# Altium schematic sheet ASM001-design-1.SchDoc
size 558 x 431 mm
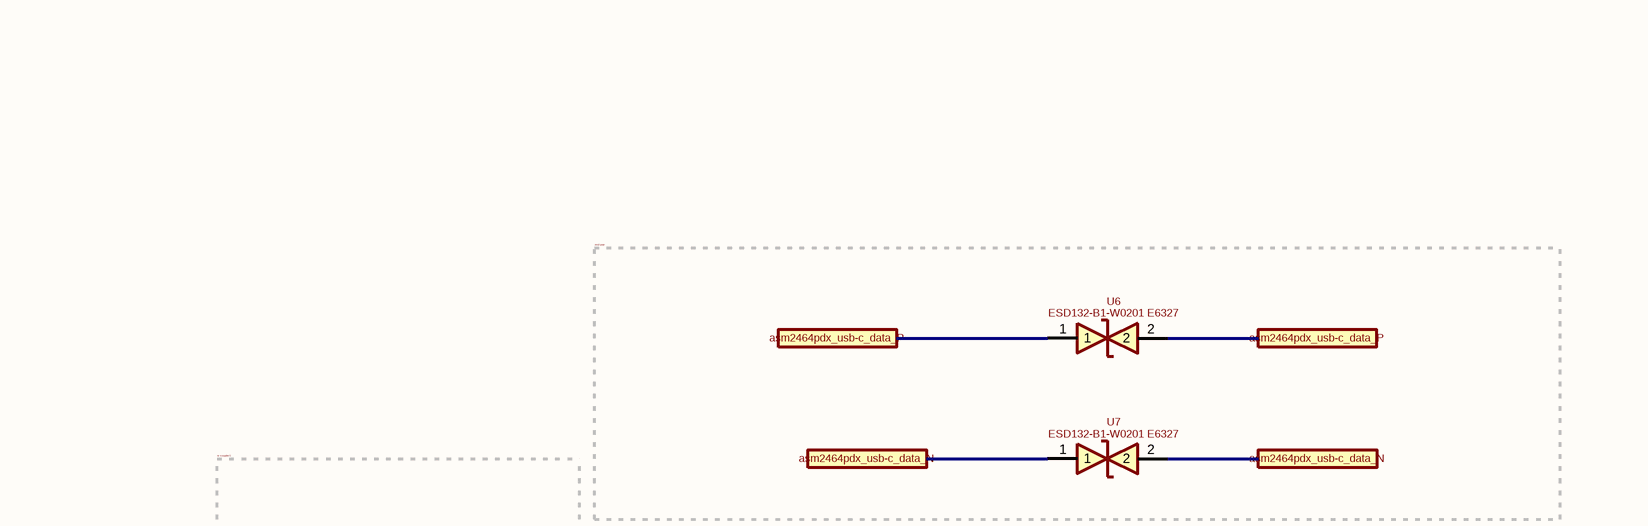
[diagram p0: ASM001-design-1.SchDoc, top column 2 of 4]
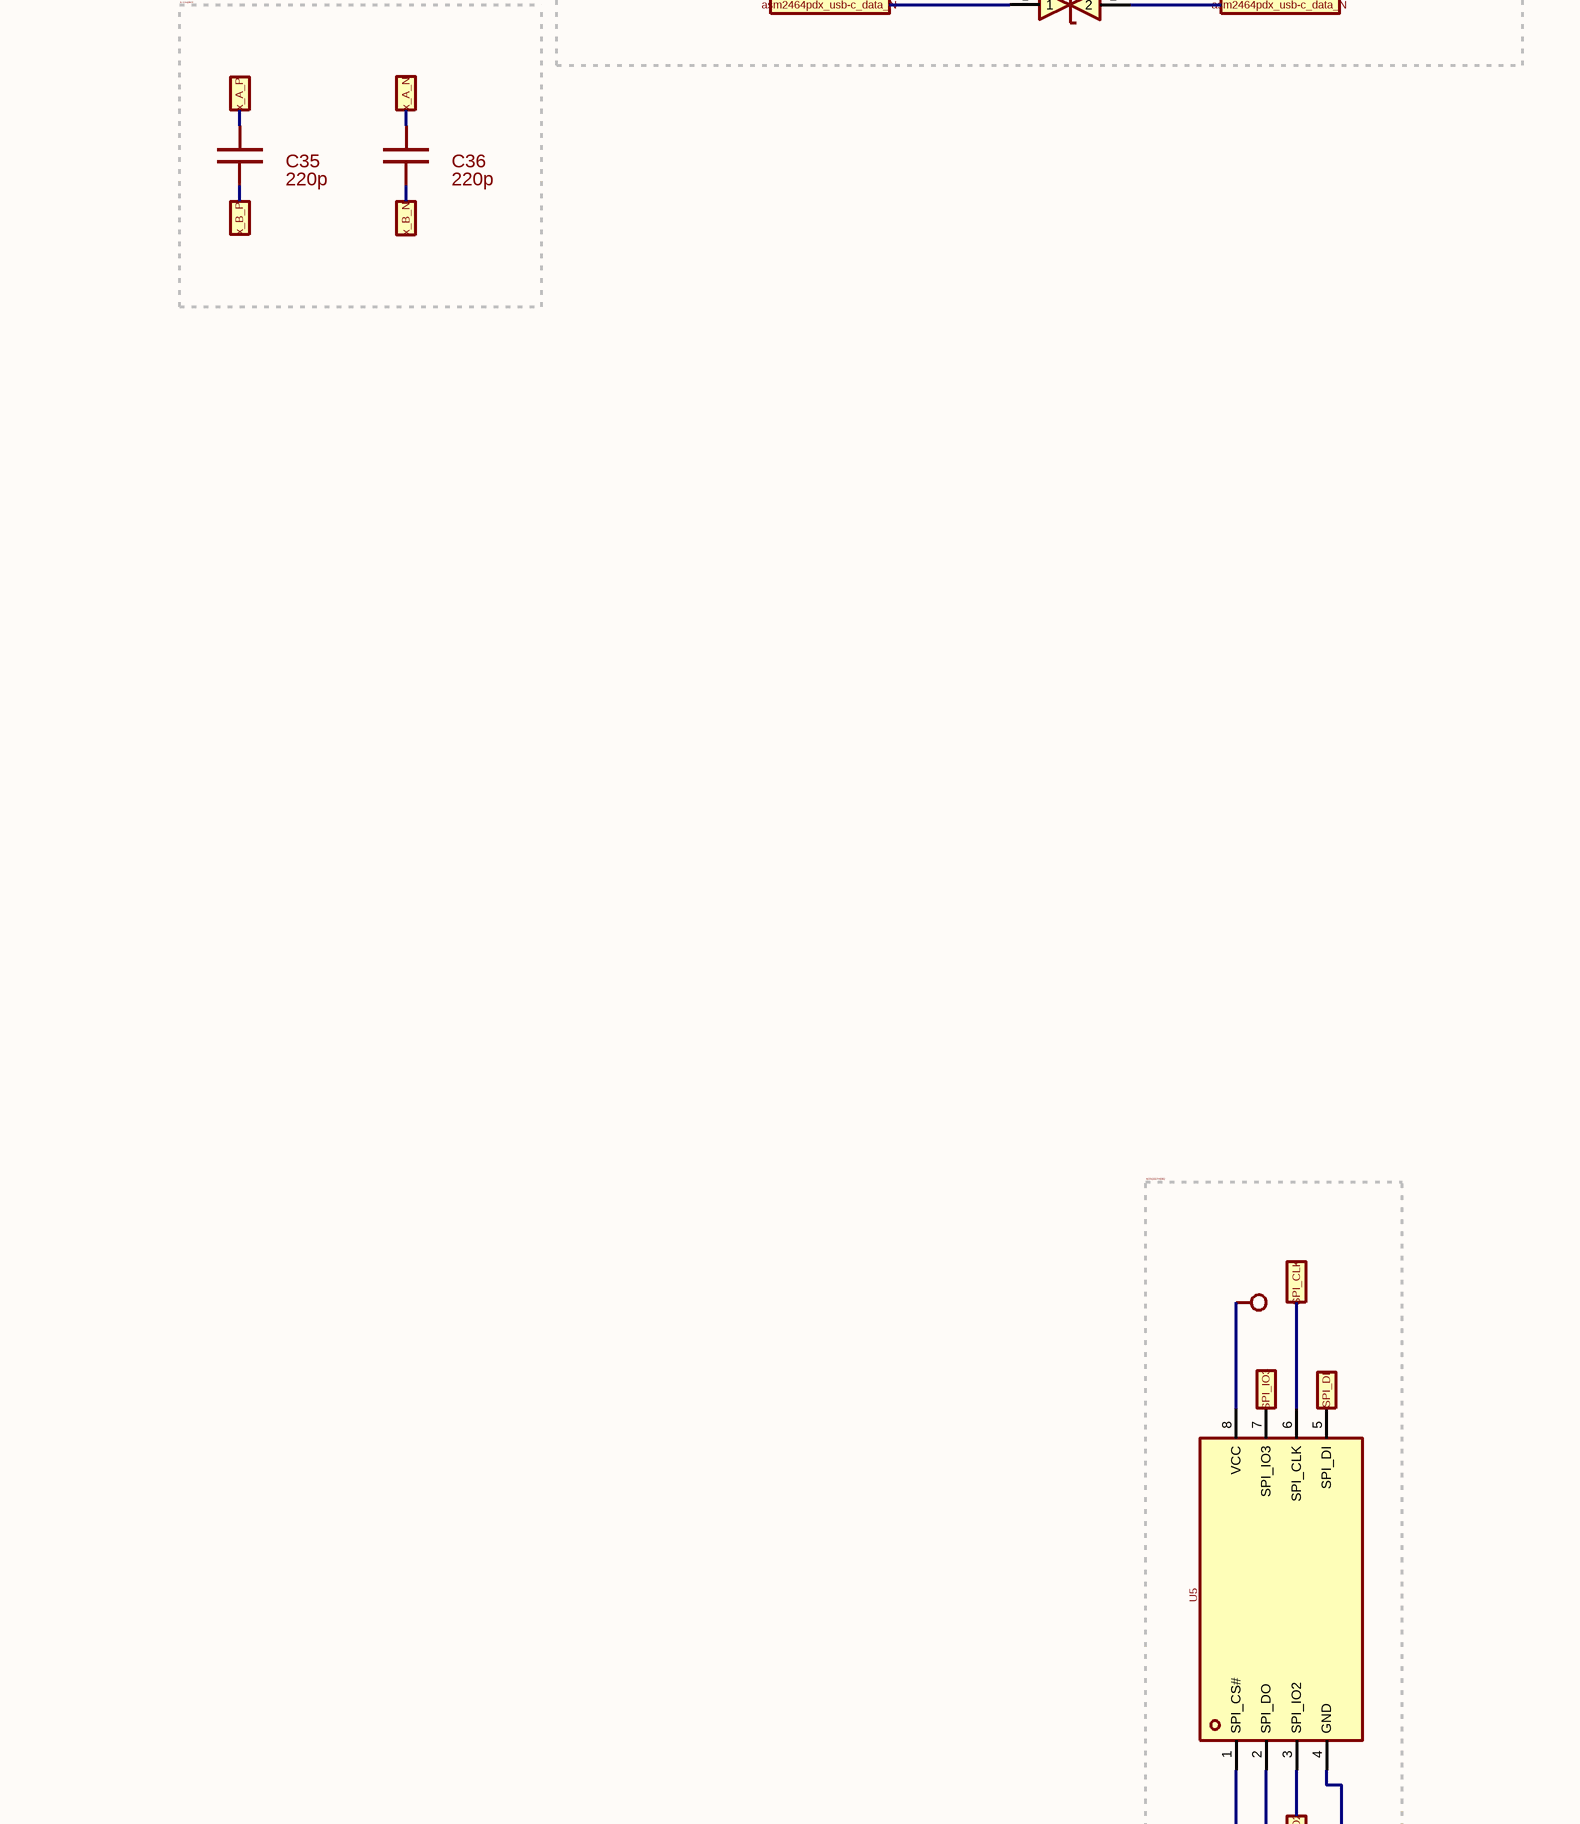
[diagram p1: ASM001-design-1.SchDoc, centre column 2 of 4]
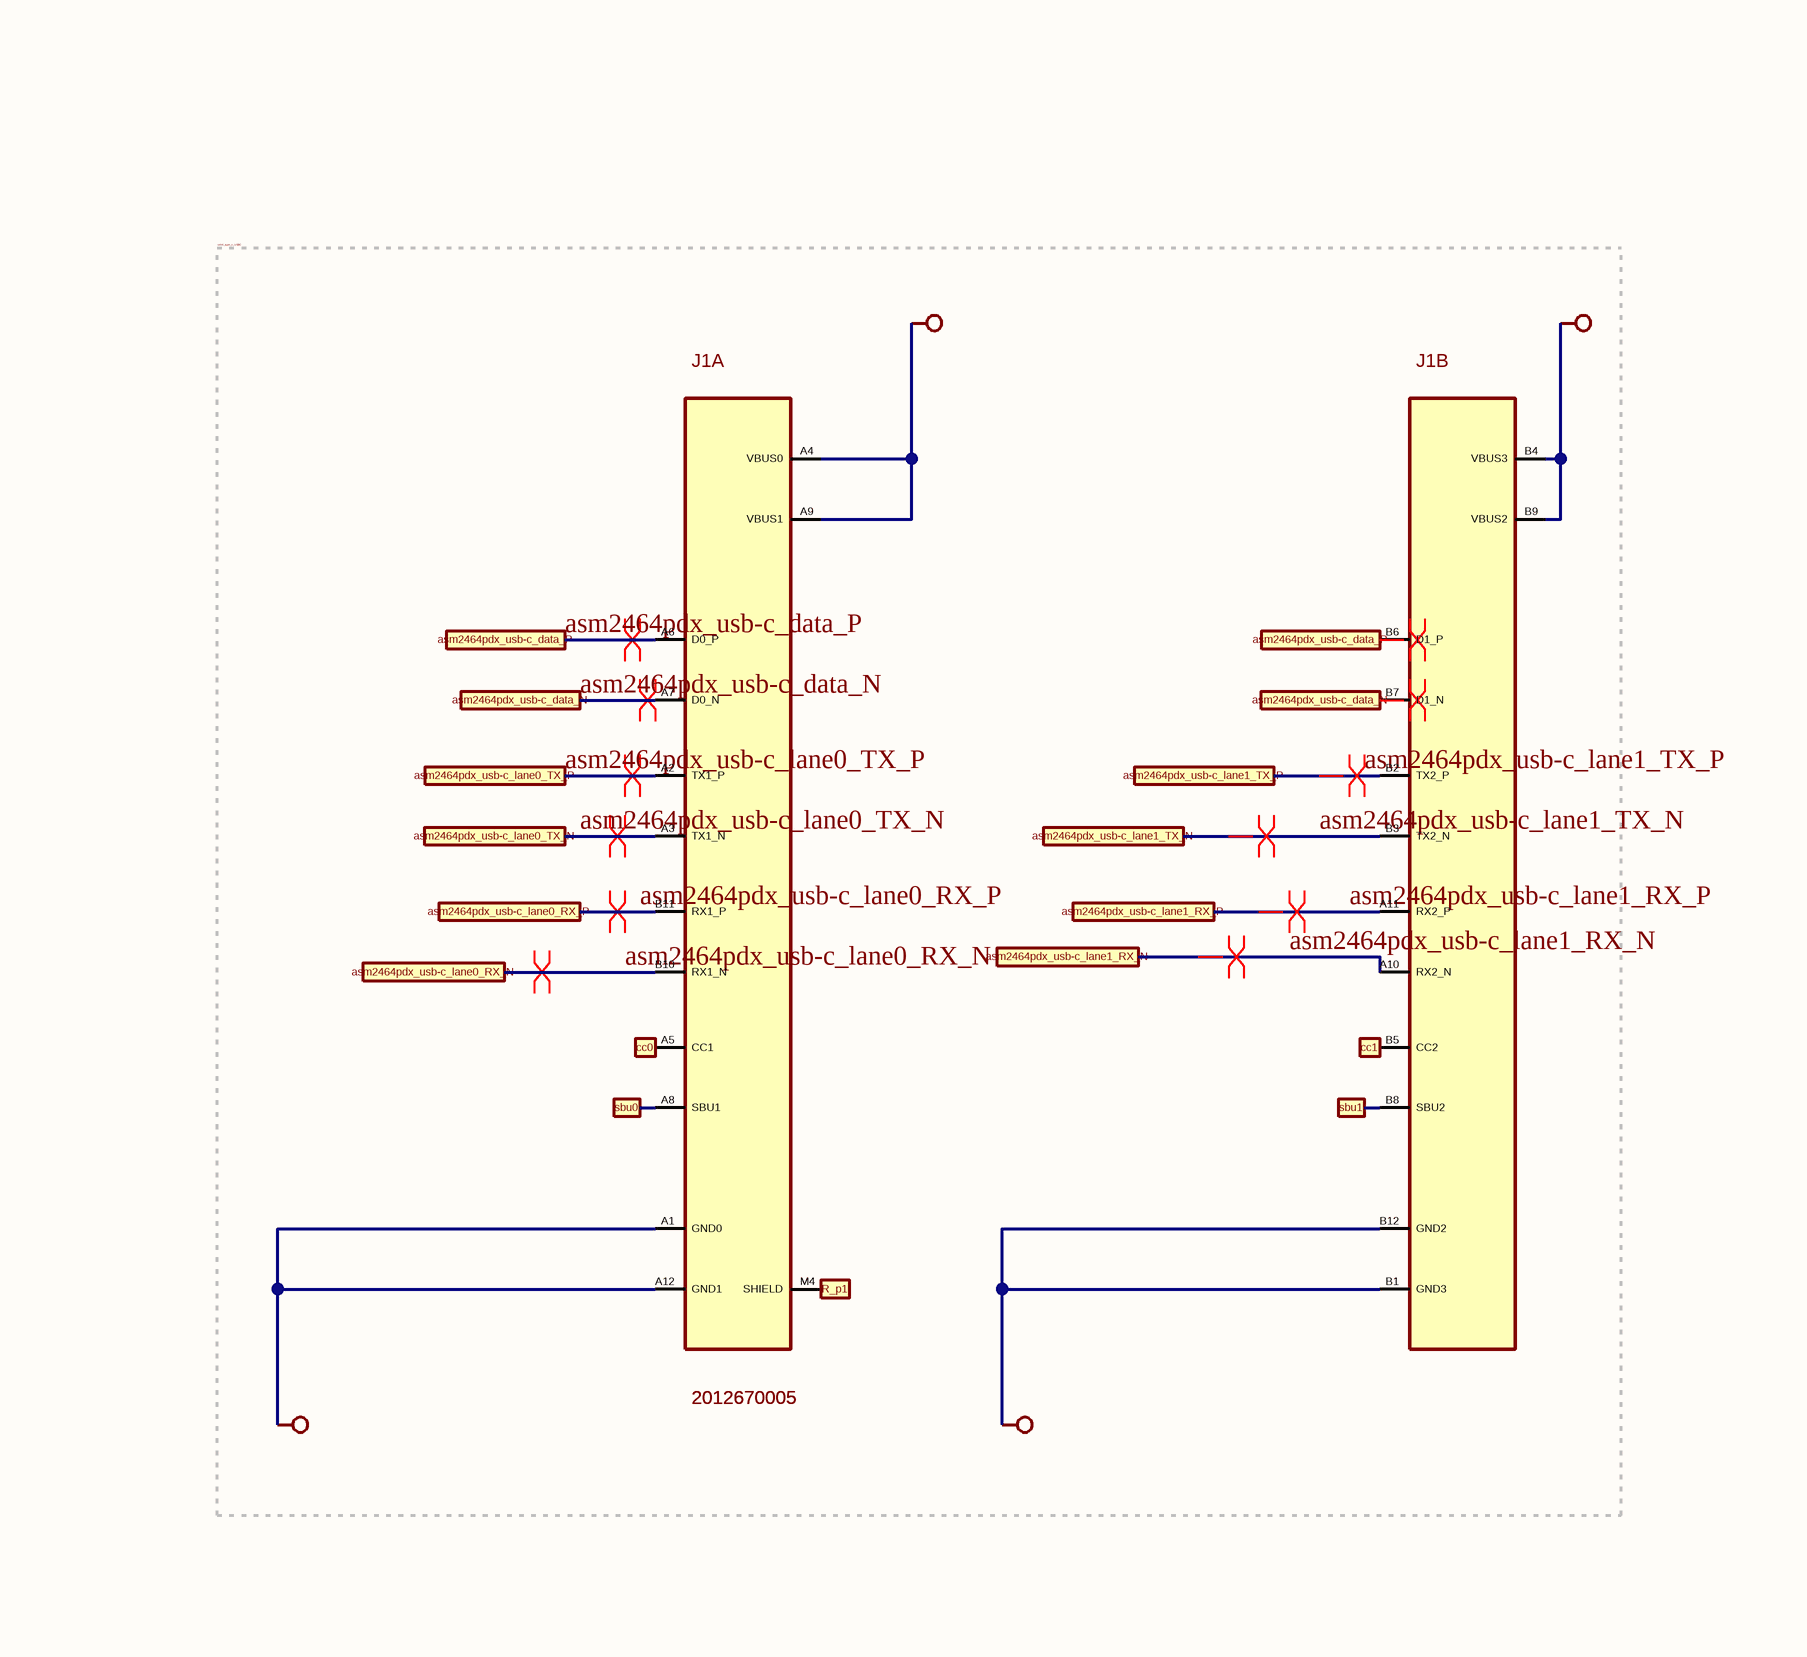
[diagram p2: ASM001-design-1.SchDoc, centre column 3 of 4]
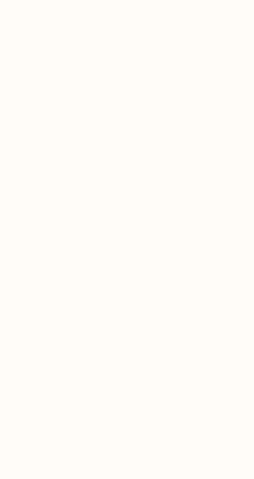
[diagram p3: ASM001-design-1.SchDoc, centre column 4 of 4]
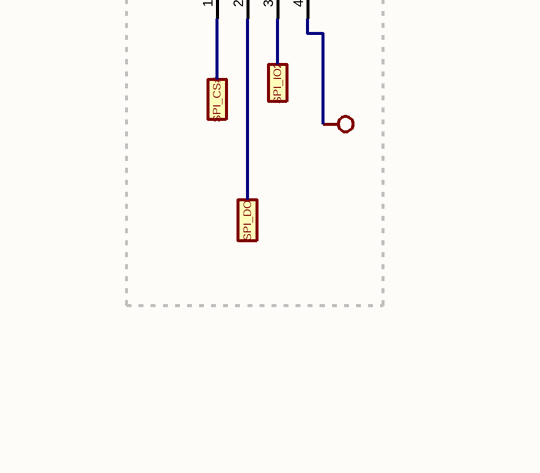
[diagram p4: ASM001-design-1.SchDoc, bottom column 2 of 4]
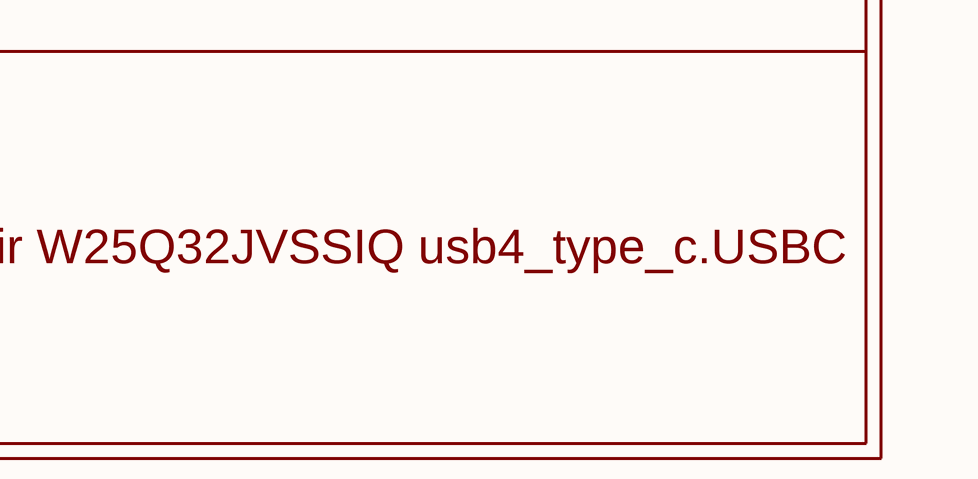
[diagram p5: ASM001-design-1.SchDoc, bottom column 4 of 4]

## Parts
C35  value 220p  [SMT_0201$1]  (hidden comment: block_cap)
C36  value 220p  [SMT_0201$1]  (hidden comment: block_cap)
J1  value 2012670005  value 2012670005  [USB_TYPE_C_CONNECTOR]  (hidden comment: conn_component)  (parts A,B of 2)
U5  value W25Q32JVSSIQ  [LP$1]  (hidden comment: C82344)
U6  value ESD132-B1-W0201 E6327  [LP$3]  (hidden comment: C535164)
U7  value ESD132-B1-W0201 E6327  [LP$3]  (hidden comment: C535164)

## Blocks framed on the sheet
esd-pair: U6 U7
tx-coupler1: C35 C36
usb4_type_c_USBC: J1
W25Q32JVSSIQ: U5

## Ports
asm2464pdx_usb-c_data_N, asm2464pdx_usb-c_data_P, asm2464pdx_usb-c_lane0_RX_N, asm2464pdx_usb-c_lane0_RX_P, asm2464pdx_usb-c_lane0_TX_N, asm2464pdx_usb-c_lane0_TX_P, asm2464pdx_usb-c_lane1_RX_N, asm2464pdx_usb-c_lane1_RX_P, asm2464pdx_usb-c_lane1_TX_N, asm2464pdx_usb-c_lane1_TX_P, cc0, cc1, R_p1, sbu0, sbu1, SPI_CLK, SPI_CS#, SPI_DI, SPI_DO, SPI_IO2, SPI_IO3, x_A_N, x_A_P, x_B_N, x_B_P

## Nets
NetJ1_A1: J1.A1(GND0) J1.A4(VBUS0) J1.A9(VBUS1) J1.A12(GND1) J1.B1(GND3) J1.B4(VBUS3) J1.B9(VBUS2) J1.B12(GND2) U5.4(GND) U5.8(VCC)
asm2464pdx_usb-c_data_N: J1.A7(D0_N) J1.B7(D1_N) U7.1 U7.2 ; port asm2464pdx_usb-c_data_N
asm2464pdx_usb-c_data_P: J1.A6(D0_P) J1.B6(D1_P) U6.1 U6.2 ; port asm2464pdx_usb-c_data_P
asm2464pdx_usb-c_lane0_RX_N: J1.B10(RX1_N) ; port asm2464pdx_usb-c_lane0_RX_N
asm2464pdx_usb-c_lane0_RX_P: J1.B11(RX1_P) ; port asm2464pdx_usb-c_lane0_RX_P
asm2464pdx_usb-c_lane0_TX_N: J1.A3(TX1_N) ; port asm2464pdx_usb-c_lane0_TX_N
asm2464pdx_usb-c_lane0_TX_P: J1.A2(TX1_P) ; port asm2464pdx_usb-c_lane0_TX_P
asm2464pdx_usb-c_lane1_RX_N: J1.A10(RX2_N) ; port asm2464pdx_usb-c_lane1_RX_N
asm2464pdx_usb-c_lane1_RX_P: J1.A11(RX2_P) ; port asm2464pdx_usb-c_lane1_RX_P
asm2464pdx_usb-c_lane1_TX_N: J1.B3(TX2_N) ; port asm2464pdx_usb-c_lane1_TX_N
asm2464pdx_usb-c_lane1_TX_P: J1.B2(TX2_P) ; port asm2464pdx_usb-c_lane1_TX_P
cc0: J1.A5(CC1) ; port cc0
cc1: J1.B5(CC2) ; port cc1
R_p1: J1.M4(SHIELD) ; port R_p1
sbu0: J1.A8(SBU1) ; port sbu0
sbu1: J1.B8(SBU2) ; port sbu1
SPI_CLK: U5.6(SPI_CLK) ; port SPI_CLK
SPI_CS#: U5.1(SPI_CS#) ; port SPI_CS#
SPI_DI: U5.5(SPI_DI) ; port SPI_DI
SPI_DO: U5.2(SPI_DO) ; port SPI_DO
SPI_IO2: U5.3(SPI_IO2) ; port SPI_IO2
SPI_IO3: U5.7(SPI_IO3) ; port SPI_IO3
x_A_N: C36.1 ; port x_A_N
x_A_P: C35.1 ; port x_A_P
x_B_N: C36.2 ; port x_B_N
x_B_P: C35.2 ; port x_B_P

## Layout directives
differential pair: asm2464pdx_usb-c_data_N, asm2464pdx_usb-c_data_P
differential pair; rule Signal Stimulus [Kind - Single Pulse    Level - High    Start Time = 0.000    Stop Time = 25.00p    Period Time = 50.00p]: asm2464pdx_usb-c_lane0_RX_N, asm2464pdx_usb-c_lane0_RX_P, asm2464pdx_usb-c_lane0_TX_N, asm2464pdx_usb-c_lane0_TX_P, asm2464pdx_usb-c_lane1_RX_P, asm2464pdx_usb-c_lane1_TX_N, asm2464pdx_usb-c_lane1_TX_P
differential pair; rule Signal Stimulus [Kind - Single Pulse    Level - High    Start Time = 0.000    Stop Time = 2.000    Period Time = 50.00p]: asm2464pdx_usb-c_lane1_RX_N

## Notes on the sheet
- tx-coupler1
  esd-pair
  W25Q32JVSSIQ
  usb4_type_c.USBC

## Library data of the parts
C35 C36 = block_cap: MPN: 02013A1R5BAT2A; Manufacturer: KYOCERA AVX; REFERENCE: false; Tolerance: 0.2%; Maximum Voltage: 6.3V; FOOTPRINT: ASM001-design:SMT_0201$1; Capacitance: 220p; Datasheet: https://datasheets.avx.com/C0GNP0-Dielectric.pdf
J1 = conn_component: pin to pad: M4>M4+M3+M2+M1; Manufacturer: Molex; REFERENCE: false; rated-temperature: Toleranced(-40.0 <= 32.5 <= 105.0); FOOTPRINT: ASM001-design:USB_TYPE_C_CONNECTOR; MPN: 2012670005; Datasheet: https://www.molex.com/content/dam/molex/molex-dot-com/products/automated/en-us/salesdrawingpdf/201/201267/2012670005_sd.pdf
U5 = C82344: manufacturer_aliases: ["Winbond Elec"]; mpn_aliases: ["W25Q32JVSSIQ"]; Manufacturer: Winbond; REFERENCE: false; cofactr_id: XX0QC6Y2U3XH; reference_prefix: U; x: 5.43; trust: low; y: 9.413; area: 51.113; FOOTPRINT: ASM001-design:LP$1; case: SOIC-8-208mil; mounting: through-hole; category: ic; MPN: W25Q32JVSSIQ; Datasheet: https://www.lcsc.com/datasheet/lcsc_datasheet_1811101814_Winbond-Elec-W25Q32JVSSIQ_C82344.pdf
U6 U7 = C535164: manufacturer_aliases: ["Infineon Technologies"]; mpn_aliases: ["ESD132-B1-W0201 E6327"]; Manufacturer: Infineon; REFERENCE: false; cofactr_id: XXRARWCT0RJE; reference_prefix: U; x: 1.102; trust: low; y: 0.762; area: 0.84; FOOTPRINT: ASM001-design:LP$3; case: WLL-2-3; category: ic; MPN: ESD132-B1-W0201 E6327; Datasheet: https://www.lcsc.com/datasheet/lcsc_datasheet_2005291706_Infineon-Technologies-ESD132-B1-W0201-E6327_C535164.pdf